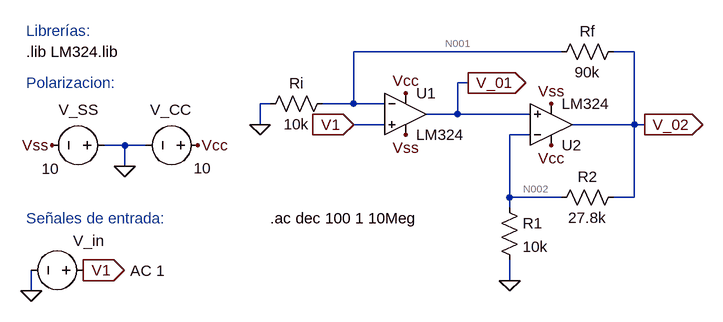
[diagram p0: schematic Lab_3_Circ_1-2.asc]
Lab_3_Circ_1-2.asc, the LTspice schematic file:
Version 4
SHEET 1 1652 680
WIRE 704 -400 384 -400
WIRE 816 -400 784 -400
WIRE 560 -352 544 -352
WIRE 256 -320 240 -320
WIRE 384 -320 384 -400
WIRE 384 -320 336 -320
WIRE 432 -320 384 -320
WIRE 544 -304 544 -352
WIRE 544 -304 496 -304
WIRE 656 -304 544 -304
WIRE 240 -288 240 -320
WIRE 432 -288 384 -288
WIRE 816 -288 816 -400
WIRE 816 -288 720 -288
WIRE 832 -288 816 -288
WIRE 656 -272 624 -272
WIRE 32 -256 0 -256
WIRE 64 -256 32 -256
WIRE 32 -224 32 -256
WIRE 624 -176 624 -272
WIRE 704 -176 624 -176
WIRE 816 -176 816 -288
WIRE 816 -176 784 -176
WIRE 624 -160 624 -176
WIRE 624 -48 624 -80
WIRE -112 -32 -112 -64
FLAG 624 -48 0
FLAG 144 -256 Vcc
FLAG 464 -336 Vcc
FLAG -80 -256 Vss
FLAG 464 -272 Vss
FLAG 32 -224 0
FLAG -112 -32 0
FLAG 384 -288 V1
IOPIN 384 -288 In
FLAG -32 -64 V1
IOPIN -32 -64 Out
FLAG 832 -288 V_02
IOPIN 832 -288 Out
FLAG 688 -256 Vcc
FLAG 688 -320 Vss
FLAG 240 -288 0
FLAG 560 -352 V_01
IOPIN 560 -352 Out
SYMBOL OpAmps\\opamp2 464 -368 R0
SYMATTR InstName U1
SYMATTR Value LM324
SYMBOL res 608 -176 R0
SYMATTR InstName R1
SYMATTR Value 10k
SYMBOL res 688 -160 R270
WINDOW 0 32 56 VTop 2
WINDOW 3 0 56 VBottom 2
SYMATTR InstName R2
SYMATTR Value 27.8k
SYMBOL res 800 -416 R90
WINDOW 0 0 56 VBottom 2
WINDOW 3 32 56 VTop 2
SYMATTR InstName Rf
SYMATTR Value 90k
SYMBOL res 240 -304 R270
WINDOW 0 32 56 VTop 2
WINDOW 3 0 56 VBottom 2
SYMATTR InstName Ri
SYMATTR Value 10k
SYMBOL voltage -16 -64 M270
WINDOW 0 45 31 VLeft 2
WINDOW 3 1 -53 VLeft 2
WINDOW 123 -1 -56 VLeft 2
WINDOW 39 0 0 Left 0
SYMATTR InstName V_in
SYMATTR Value ""
SYMATTR Value2 AC 1
SYMBOL voltage 160 -256 R90
WINDOW 0 -55 25 VRight 2
WINDOW 3 35 -5 VRight 2
WINDOW 123 0 0 Left 0
WINDOW 39 0 0 Left 0
SYMATTR InstName V_CC
SYMATTR Value 10
SYMBOL voltage 16 -256 R90
WINDOW 0 -55 25 VRight 2
WINDOW 3 36 85 VRight 2
WINDOW 123 0 0 Left 0
WINDOW 39 0 0 Left 0
SYMATTR InstName V_SS
SYMATTR Value 10
SYMBOL OpAmps\\opamp2 688 -224 M180
SYMATTR InstName U2
SYMATTR Value LM324
TEXT -120 -400 Left 2 !.lib LM324.lib
TEXT -120 -432 Left 2 ;Librerías:
TEXT -120 -352 Left 2 ;Polarizacion:
TEXT -120 -144 Left 2 ;Señales de entrada:
TEXT 256 -144 Left 2 !.ac dec 100 1 10Meg

The netlist it stands for:
* Lab_3_Circ_1-2.asc
XU1 V1 N001 Vcc Vss V_01 LM324  ; pins In+ In- V+ V- OUT
R1 N002 0 10k
R2 N002 V_02 27.8k
Rf V_02 N001 90k
Ri 0 N001 10k
V_in V1 0 AC 1
V_CC Vcc 0 10
V_SS 0 Vss 10
XU2 V_01 N002 Vcc Vss V_02 LM324  ; pins In+ In- V+ V- OUT
.lib LM324.lib
* Librerías:
* Polarizacion:
* Señales de entrada:
.ac dec 100 1 10Meg
.backanno
.end

* Results of the author's LTspice run, read from the files saved beside the schematic
* Operating Point, zero values left out:
*   V(v_01) = -383.5 µV
*   V(vss) = -10 V
*   V(vcc) = 10 V
*   V(n001) = -33.65 µV
*   V(n002) = -417.1 µV
*   V(v_02) = -2.131 mV
*   I(Ri) = 3.365 nA
*   I(Rf) = -23.3 nA
*   I(R2) = 61.65 nA
*   I(R1) = -41.71 nA
*   I(V_ss) = -1.34 mA
*   I(V_cc) = -1.34 mA
*   I(V_in) = 19.92 nA
*   Ix(u1:1) = -19.92 nA
*   Ix(u1:2) = -19.94 nA
*   Ix(u1:3) = 669.9 µA
*   Ix(u1:4) = -669.8 µA
*   Ix(u1:5) = 19.92 nA
*   Ix(u2:1) = -19.92 nA
*   Ix(u2:2) = -19.94 nA
*   Ix(u2:3) = 669.9 µA
*   Ix(u2:4) = -669.8 µA
*   Ix(u2:5) = 84.96 nA
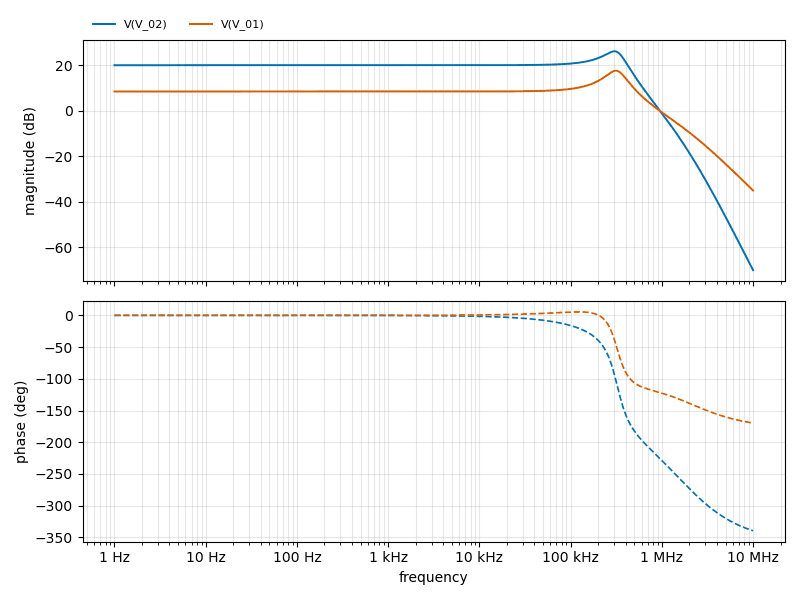
[diagram p1: AC Analysis of Lab_3_Circ_1-2.asc, plotted from the saved traces]
* AC Analysis, 1 run:
*   V(V_02): 20.00 dB at 1 Hz, -70.04 dB at 10 MHz, peak 26.11 dB at 302 kHz, 3 dB below the peak at 199.8 kHz and 375.6 kHz
*   V(V_01): 8.45 dB at 1 Hz, -35.05 dB at 10 MHz, peak 17.59 dB at 316.2 kHz, 3 dB below the peak at 230.9 kHz and 394.8 kHz